# Altium schematic sheet Fan_Drive.SchDoc: Fan Drive Circuitry
size A4; DrawnBy: Samyar Sadat Akhavi; Revision: 1.0; SheetNumber: 10; SheetTotal: 14
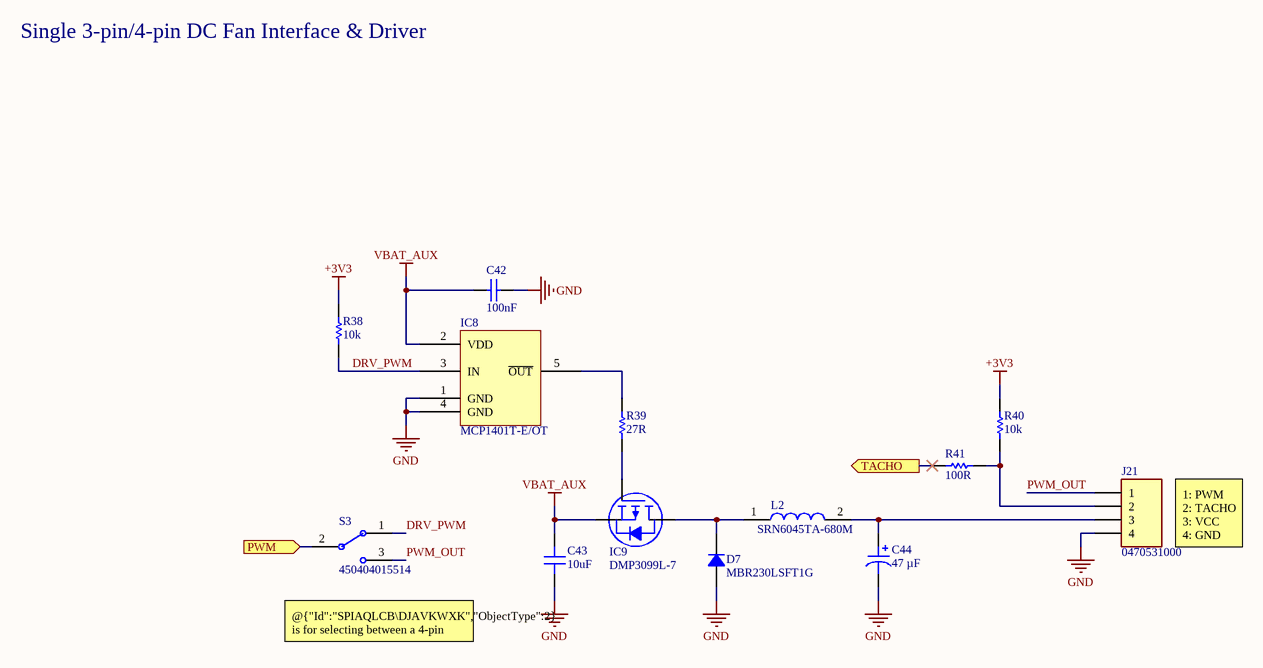
[diagram p0: Fan_Drive.SchDoc]

## Parts
?  (no value)  (graphical)
C42  100nF  [CAP_SMD_603]
C43  10uF  [CAP 0805_2012]
C44  47 µF  [CAP ALSMD 6.6MM H5.4MM]
D7  MBR230LSFT1G  [SOD123F]
IC8  MCP1401T-E/OT  [MICROCHIP SOT-23-5 OT]
IC9  DMP3099L-7  [DIODES SOT-23-3]
J21  0470531000  [0470531000]
L2  SRN6045TA-680M  [SRN6045TA]
R38  10k  [RES_0603]
R39  27R  [RES_0603]
R40  10k  [RES_0603]
R41  100R  [RES_0603]
S3  450404015514  [WURTH WS-SLSU 450404015514]

## Ports
PWM (in, see Thermal[4B]), TACHO (out, see Thermal[4B])

## Nets
+3V3: R38.2 R40.1
GND: C42.2 C43.1 C44.2 D7.1 IC8.1(GND) IC8.4(GND) J21.4
VBAT_AUX: C42.1 C43.2 IC8.2(VDD) IC9.2(S)
DRV_PWM: IC8.3(IN) R38.1 S3.1
PWM: S3.2(COM) ; port PWM
PWM_OUT: J21.1 S3.3
TACHO: R41.1 ; port TACHO
NetC44_1: C44.1 J21.3 L2.2
NetD7_2: D7.2 IC9.3(D) L2.1
NetIC8_5: IC8.5(~{OUT}) R39.1
NetIC9_1: IC9.1(G) R39.2
NetJ21_2: J21.2 R40.2 R41.2

## Notes on the sheet
- Single 3-pin/4-pin DC Fan Interface & Driver
- 1: PWM
  2: TACHO
  3: VCC
  4: GND
- (near S3) @{"Id":"SPIAQLCB\DJAVKWXK","ObjectType":2} is for selecting between a 4-pin PWM fan or a 3-pin DC fan.
- Sub-Project:
- Size:
- Drawn By:
- Revision:
- Date:
- File:
- Sheet:
- of

## Library data of the parts
? = Standard Title Block
C42 = Non-polar Capacitor: Generic Ceramic Capacitor; Voltage: 6.3V; Value: 100nF
C43 = CL21A106KOQNNNE: CAP CER 10UF 16V X5R 0805; manufacturer: Samsung Electro-Mechanics; Capacitance: 10 µF; Tolerance: ±10%; Part Number: CL21A106KOQNNNE; Applications: General Purpose; componentlink1description: Datasheet; componentlink1url: http://www.samsungsem.com/kr/support/product-search/mlcc/CL21A106KOQNNNE.jsp; componentlink2description: DigiKey Link; componentlink2url: https://www.digikey.com/en/products/detail/samsung-electro-mechanics/CL21A106KOQNNNE/3886754; Device Package: 0805 (2012 Metric); lastupdated: 2/9/2024 8:15:37 PM; Lifecycle Status: Active; Minimum Order: 1; Mounting Type: Surface Mount, MLCC; Operating Temperature: -55°C ~ 85°C; Package / Case: 0805 (2012 Metric); packaging: TapeAndReel; partid: 14297; Part Status: Active; price: 0.01; series: CL; Size / Dimension: 0.079" L x 0.049" W (2.00mm x 1.25mm); Supplier 1: DigiKey; Supplier Part Number 1: 1276-1096-1-ND; Temperature Coefficient: X5R; Thickness (Max): 0.055" (1.40mm); value: 10uF; Voltage - Rated: 16V
C44 = 865080443007: CAP ALUM 47UF 20% 25V SMD; manufacturer: Würth Elektronik; Impedance: 560 mOhms; Lifetime @ Temp.: 2000 Hrs @ 105°C; Polarization: Polar; Ripple Current @ High Frequency: 220 mA @ 100 kHz; Ripple Current @ Low Frequency: 143 mA @ 120 Hz; Surface Mount Land Size: 0.260" L x 0.260" W (6.60mm x 6.60mm); Part Number: 865080443007; Applications: General Purpose; Capacitance: 47 µF; componentlink1description: Datasheet; componentlink1url: https://katalog.we-online.de/pbs/datasheet/865080443007.pdf; componentlink2description: DigiKey Link; componentlink2url: https://www.digikey.com/en/products/detail/würth-elektronik/865080443007/5728030; Device Package: Radial, Can - SMD; Height - Seated (Max): 0.217" (5.50mm); lastupdated: 6/3/2024 7:53:40 PM; Lifecycle Status: Active; Minimum Order: 1; Mounting Type: Surface Mount; Operating Temperature: -55°C ~ 105°C; Package / Case: Radial, Can - SMD; packaging: TapeAndReel; partid: 8980; Part Status: Active; price: 0.15; series: WCAP-ASLI; Size / Dimension: 0.248" Dia (6.30mm); Supplier 1: DigiKey; Supplier Part Number 1: 732-8435-1-ND; Tolerance: ±20%; value: 47 µF; Voltage - Rated: 25 V
D7 = MBR230LSFT1G: DIODE SCHOTTKY 30V 2A SOD123L; Manufacturer: ON Semiconductor; Current - Reverse Leakage @ Vr: 1mA @ 30V; Speed: Fast Recovery =< 500ns, > 200mA (Io); Voltage - Forward (Vf) (Max) @ If: 430mV @ 2A; Part Number: MBR230LSFT1G; ComponentLink1Description: Datasheet; ComponentLink1URL: http://www.onsemi.com/pub/Collateral/MBR230LSFT1-D.PDF; ComponentLink2Description: DigiKey Link; ComponentLink2URL: http://digikey.com/product-detail/en/on-semiconductor/MBR230LSFT1G/MBR230LSFT1GOSCT-ND/1967064; Current - Average Rectified (Io): 2A; Diode Type: Schottky; LastUpdated: 6/3/2024 7:54:57 PM; Lifecycle Status: Active; Minimum Order: 1; Mounting Type: Surface Mount; Operating Temperature - Junction: -55°C ~ 125°C; Package / Case: SOD-123F; Packaging: TapeAndReel; PartId: 2381; Part Status: Active; Price: 0.08; Series: -; Supplier 1: DigiKey; Supplier Part Number 1: MBR230LSFT1GOSCT-ND; Supplier Device Package: SOD-123L; Voltage - DC Reverse (Vr) (Max): 30V
IC8 = MCP1401T-E/OT: IC GATE DRVR LOW-SIDE SOT23-5; Manufacturer: Microchip Technology; Channel Type: Single; Current - Peak Output (Source, Sink): 500mA, 500mA; Gate Type: IGBT, N-Channel, P-Channel MOSFET; Input Type: Inverting; Logic Voltage - VIL, VIH: 0.8V, 2.4V; Number of Drivers: 1; Rise / Fall Time (Typ): 19ns, 15ns; Voltage - Supply: 4.5V ~ 18V; Part Number: MCP1401T-E/OT; ComponentLink1Description: Datasheet; ComponentLink1URL: http://www.microchip.com/mymicrochip/filehandler.aspx?ddocname=en530890; ComponentLink2Description: DigiKey Link; ComponentLink2URL: http://digikey.com/product-detail/en/microchip-technology/MCP1401T-E-OT/MCP1401T-E-OTCT-ND/1956553; Device Package: SC-74A, SOT-753; Driven Configuration: Low-Side; LastUpdated: 1/31/2020 1:34:08 AM; Lifecycle Status: Active; Minimum Order: 1; Mounting Type: Surface Mount; Operating Temperature: -40°C ~ 125°C; Package / Case: SC-74A, SOT-753; Packaging: TapeAndReel; PartId: 9; Part Status: Active; Price: 0.47; Series: -; Supplier 1: DigiKey; Supplier Part Number 1: MCP1401T-E/OTCT-ND; Supplier Device Package: SOT-23-5
IC9 = DMP3099L-7: MOSFET P-CH 30V 3.8A SOT23; Manufacturer: Diodes Incorporated; Current - Continuous Drain (Id) @ 25°C: 3.8A (Ta); Drive Voltage (Max Rds On,  Min Rds On): 4.5V, 10V; FET Type: P-Channel; Gate Charge (Qg) (Max) @ Vgs: 5.2 nC @ 4.5 V; Input Capacitance (Ciss) (Max) @ Vds: 563 pF @ 25 V; Power Dissipation (Max): 1.08W (Ta); Rds On (Max) @ Id, Vgs: 65mOhm @ 3.8A, 10V; Vgs (Max): ±20V; Vgs(th) (Max) @ Id: 2.1V @ 250µA; Part Number: DMP3099L-7; ComponentLink1Description: Datasheet; ComponentLink1URL: https://www.diodes.com/assets/Datasheets/DMP3099L.pdf; ComponentLink2Description: DigiKey Link; ComponentLink2URL: https://www.digikey.com/en/products/detail/diodes-incorporated/DMP3099L-7/4471075; Drain to Source Voltage (Vdss): 30 V; LastUpdated: 6/3/2024 8:15:20 PM; Lifecycle Status: Active; Minimum Order: 1; Mounting Type: Surface Mount; Operating Temperature: -55°C ~ 150°C (TJ); Package / Case: TO-236-3, SC-59, SOT-23-3; Packaging: TapeAndReel; Part Status: Active; Price: 0.04; Series: -; Supplier 1: DigiKey; Supplier Part Number 1: DMP3099L-7DICT-ND; Supplier Device Package: SOT-23-3; Technology: MOSFET (Metal Oxide)
J21 = 0470531000: Connector; Manufacturer_Name: Molex; Datasheet Link: https://www.molex.com/en-us/products/part-detail-pdf/470531000?display=pdf; Manufacturer_Part_Number: 0470531000; Mouser Part Number: N/A; Mouser Price/Stock: https://www.mouser.co.uk/ProductDetail/Molex/0470531000?qs=PBcRNPEHKsr8N9RyuOy6rw%3D%3D; Arrow Part Number: 0470531000; Arrow Price/Stock: https://www.arrow.com/en/products/0470531000/molex?utm_currency=USD&region=nac
L2 = SRN6045TA-680M: Inductor; Manufacturer_Name: Bourns; Datasheet Link: http://www.bourns.com/docs/Product-Datasheets/SRN6045TA.pdf; Manufacturer_Part_Number: SRN6045TA-680M; Mouser Part Number: 652-SRN6045TA-680M; Mouser Price/Stock: https://www.mouser.co.uk/ProductDetail/Bourns/SRN6045TA-680M?qs=Vt59ZOdFuWZwwb5da9XlfA%3D%3D; Arrow Part Number: SRN6045TA-680M; Arrow Price/Stock: https://www.arrow.com/en/products/srn6045ta-680m/bourns?utm_currency=USD&region=nac
R38-R41 = Resistor: Power: 1/8W
  R38 R40: Value: 10k
  R39: Value: 27R
  R41: Value: 100R
S3 = 450404015514: MINI SLIDE SWITCH 6.7 X 2.7 MM.; Manufacturer: Würth Elektronik; Rated Current: 300mA; Rated Voltage: 5VDC; Switching Function: On-On; Circuit: SPDT; Actuator Length: 1.50mm; Actuator Type: Standard; Contact Timing: Non-Shorting (BBM); Current Rating (Amps): 300mA (DC); Voltage Rating - DC: 5 V; ComponentLink1Description: Datasheet; ComponentLink1URL: https://katalog.we-online.de/em/datasheet/450404015514.pdf; ComponentLink2Description: DigiKey Link; ComponentLink2URL: https://www.digikey.com/en/products/detail/würth-elektronik/450404015514/9950812; Packaging: TapeAndReel; Publisher: Wurth Elektronik; Contact Material: Copper Alloy; Mounting Technology: SMT; Operating Temperature: -40°C ~ 85°C; Contact Plating: Silver; Part Number: 450404015514; Published Date: September 2019; Terminal Material: Copper Alloy; Size: 6.7x2.7mm; Terminal Plating: Silver; Contact Finish: Silver; LastUpdated: 6/20/2022 1:21:56 PM; Lifecycle Status: Active; Minimum Order: 1; Mounting Type: Surface Mount; PartId: 5; Part Status: Active; Price: 0.48; Series: WS-SLSU; Supplier 1: DigiKey; Supplier Part Number 1: 732-13665-1-ND; Switch Function: On-On; Termination Style: SMD (SMT) Tab